# Altium schematic sheet DOIBoard2.SchDoc: DOI Board 2
size A4; Author: YIng Zuo; Revision: V1.0
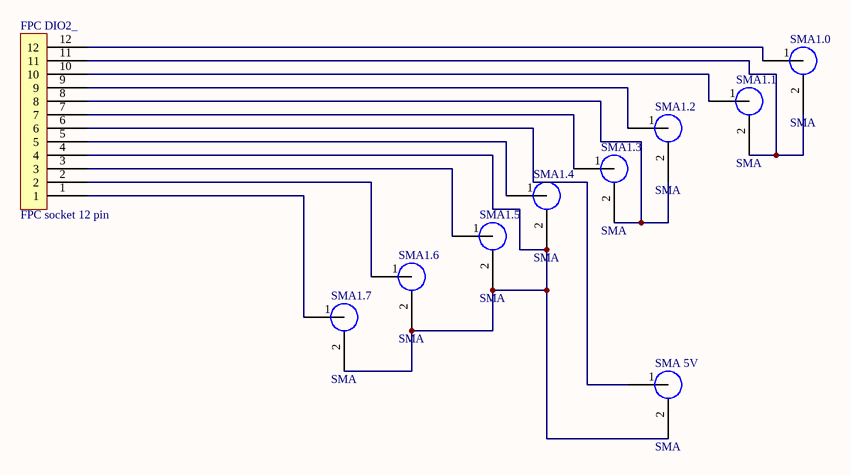
[diagram p0: DOIBoard2.SchDoc]

## Parts
FPC_DIO2_  FPC socket 12 pin  [FPC 12pin]
SMA1.0  SMA  [SMA]
SMA1.1  SMA  [SMA]
SMA1.2  SMA  [SMA]
SMA1.3  SMA  [SMA]
SMA1.4  SMA  [SMA]
SMA1.5  SMA  [SMA]
SMA1.6  SMA  [SMA]
SMA1.7  SMA  [SMA]
SMA_5V  SMA  [SMA]

## Nets
NetFPC_DIO2__1: FPC_DIO2_.1 SMA1.7.1(Core)
NetFPC_DIO2__2: FPC_DIO2_.2 SMA1.6.1(Core)
NetFPC_DIO2__3: FPC_DIO2_.3 SMA1.5.1(Core)
NetFPC_DIO2__4: FPC_DIO2_.4 SMA1.4.2(Ground) SMA1.5.2(Ground) SMA1.6.2(Ground) SMA1.7.2(Ground) SMA_5V.2(Ground)
NetFPC_DIO2__5: FPC_DIO2_.5 SMA1.4.1(Core)
NetFPC_DIO2__6: FPC_DIO2_.6 SMA_5V.1(Core)
NetFPC_DIO2__7: FPC_DIO2_.7 SMA1.3.1(Core)
NetFPC_DIO2__8: FPC_DIO2_.8 SMA1.2.2(Ground) SMA1.3.2(Ground)
NetFPC_DIO2__9: FPC_DIO2_.9 SMA1.2.1(Core)
NetFPC_DIO2__10: FPC_DIO2_.10 SMA1.1.1(Core)
NetFPC_DIO2__11: FPC_DIO2_.11 SMA1.0.2(Ground) SMA1.1.2(Ground)
NetFPC_DIO2__12: FPC_DIO2_.12 SMA1.0.1(Core)

## Notes on the sheet
- Title
- Size:
- Date:
- A4
- Number:
- Time:
- Revision:
- Sheet
- of
- File: